# EAGLE design A4a ESP32 WiFi BLE (EAGLE 9.6.2)
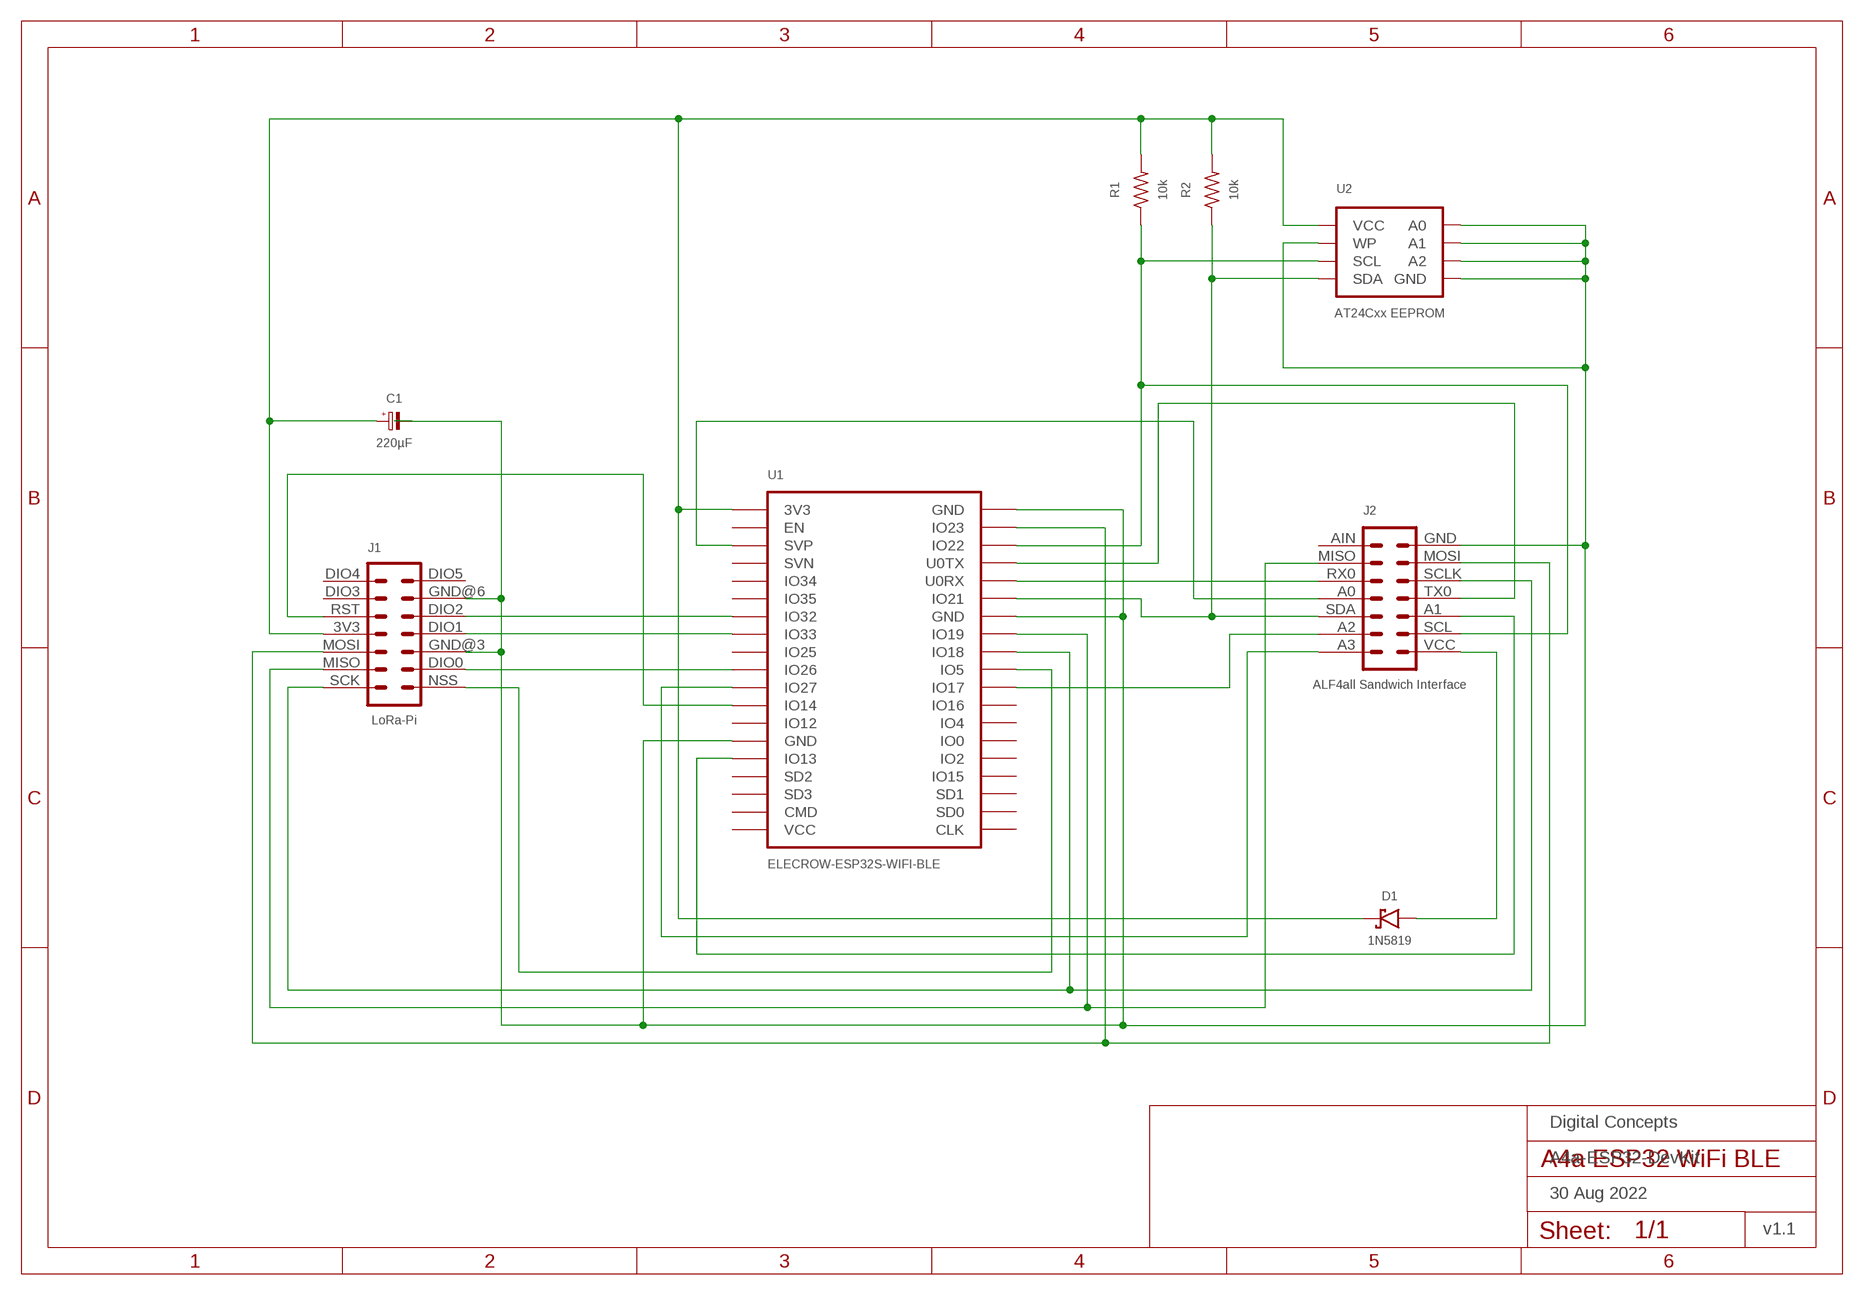
[diagram p0: schematic, sheet 1]
FRAME1 (A4L-LOC): DATE: 30 Aug 2022; OWNER: Digital Concepts; TITLE: A4a-ESP32-DevKit; VERSION: v1.1

## Parts
C1  220µF  CAPACITOR-3528-TANTALUM  [C3528-21]
D1  1N5819  DIODE-SCHOTTKY-1N5819  [SOD-123]
J1  LoRa-Pi  RFM95W-PI-HEADER  [RFM95W-PI]
J2  ALF4all Sandwich Interface  HEADER-2X7-ALF4ALL-PROCESSOR-B  [CONN_2X7-ALF4ALL-PROCESSOR-B]
R1  10k  RESISTORR0805  [R0805]
R2  10k  RESISTORR0805  [R0805]
U1  ELECROW-ESP32S-WIFI-BLE  [ELECROW-ESP32S-WIFI-BLE]
U2  AT24Cxx EEPROM  AT24CXX-EEPROM  [SOP-8]

## Nets
GND: C1.2(-) J1.GND@3 J1.GND@6 J2.GND U1.GND@13(GND) U1.GND@19(GND) U1.GND@33(GND) U2.P$1(A0) U2.P$2(A1) U2.P$3(A2) U2.P$4(GND) U2.P$7(WP)
N$2: J2.A3 U1.IO27
N$3: J2.A1 U1.IO13
N$4: J1.RST U1.IO14
N$5: D1.A J2.VCC
N$6: J1.SCK J2.SCLK U1.IO18
N$7: J2.RX0 U1.U0RX
N$9: J1.DIO0 U1.IO26
N$10: J2.SDA R2.1 U1.IO21 U2.P$5(SDA)
N$11: J2.SCL R1.1 U1.IO22 U2.P$6(SCL)
N$12: J1.MISO J2.MISO U1.IO19
N$13: J1.MOSI J2.MOSI U1.IO23
N$14: J2.TX0 U1.U0TX
N$15: J1.NSS U1.IO5
N$17: J2.A2 U1.IO17
N$21: J1.DIO1 U1.IO33
N$22: J1.DIO2 U1.IO32
N$23: J2.A0 U1.SVP
VCC: C1.1(+) D1.C J1.3V3 R1.2 R2.2 U1.3V3 U2.P$8(VCC)
Unconnected: J1.DIO3 J1.DIO4 J1.DIO5 J2.AIN U1.CLK U1.CMD U1.EN U1.IO0 U1.IO2 U1.IO4 U1.IO12 U1.IO15 U1.IO16 U1.IO25 U1.IO34 U1.IO35 U1.SD0 U1.SD1 U1.SD2 U1.SD3 U1.SVN U1.VCC

## Library data of the parts
C1 = digitalconcepts:CAPACITOR-3528-TANTALUM: Capacitor Tantalum 3528 (KEMET B)
D1 = digitalconcepts:DIODE-SCHOTTKY-1N5819: 1N5819 Schottky Diode SOD-123
J1 = digitalconcepts:RFM95W-PI-HEADER: RFM95W LoRa Wireless Transceiver Raspberry Pi Daughter Board
J2 = digitalconcepts:HEADER-2X7-ALF4ALL-PROCESSOR-B: ALF4all 'Sandwich' Processor (Bottom) 2x7 Pin Header Header soldered to underside of PCB
R1 R2 = digitalconcepts:RESISTOR: Resistor; SPICEPREFIX: R
U1 = digitalconcepts:ELECROW-ESP32S-WIFI-BLE: Elecrow ESP32S WiFi/BLE DevKit
U2 = digitalconcepts:AT24CXX-EEPROM: AT24Cxx EEPROM SOP-8

## Board
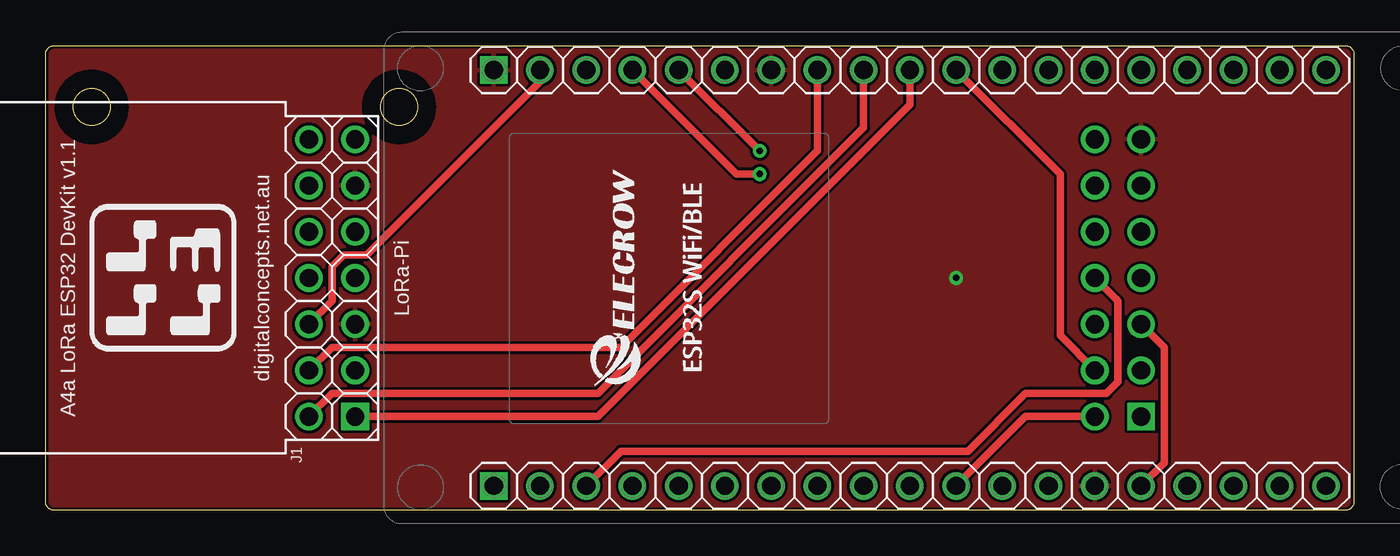
[diagram p1: board, top side]
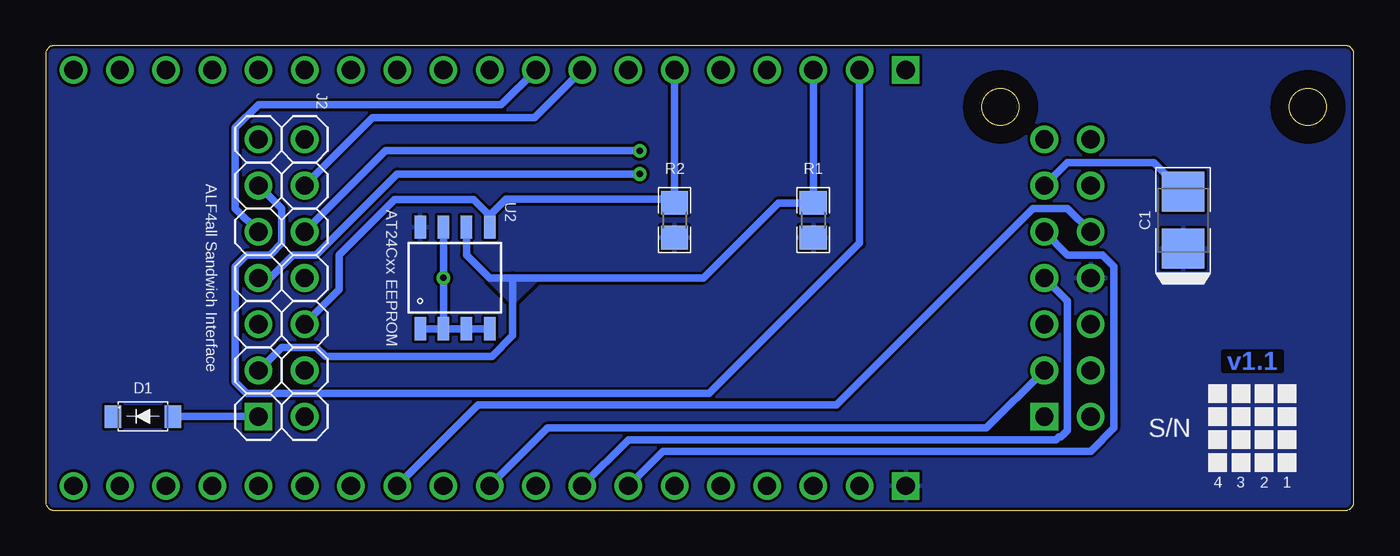
[diagram p2: board, bottom side, seen from below]

Size 71.89 x 25.56 mm. Coordinates in mm from the lower left corner, seen from the top.
Outline: 71.43,25.56 71.46,25.56 71.5,25.55 71.53,25.54 71.56,25.53 71.59,25.52 71.62,25.51 71.65,25.49 71.67,25.48 71.7,25.46 71.72,25.44 71.74,25.41 71.77,25.39 71.79,25.37 71.8,25.34 71.82,25.31 71.84,25.28 71.86,25.22 71.87,25.19 71.88,25.16 71.89,25.13 71.89,25.1 71.89,0.47 71.89,0.43 71.88,0.4 71.87,0.37 71.86,0.33 71.84,0.28 71.82,0.25 71.8,0.22 71.79,0.19 71.77,0.17 71.74,0.15 71.72,0.12 71.7,0.1 71.67,0.09 71.65,0.07 71.62,0.05 71.59,0.04 71.56,0.03 71.53,0.02 71.5,0.01 71.46,0 71.43,0 0.46,0 0.42,0 0.39,0.01 0.36,0.02 0.33,0.03 0.27,0.05 0.24,0.07 0.22,0.09 0.19,0.1 0.17,0.12 0.14,0.15 0.12,0.17 0.1,0.19 0.08,0.22 0.07,0.25 0.05,0.28 0.04,0.31 0.03,0.33 0.02,0.37 0.01,0.4 0,0.43 0,0.47 0,25.1 0,25.13 0.01,25.16 0.02,25.19 0.03,25.22 0.04,25.25 0.05,25.28 0.07,25.31 0.08,25.34 0.1,25.37 0.12,25.39 0.17,25.44 0.19,25.46 0.22,25.48 0.24,25.49 0.27,25.51 0.33,25.53 0.36,25.54 0.39,25.55 0.42,25.56 0.46,25.56 71.43,25.56
Outline: circle at 19.42,22.18 radius 1.02
Outline: circle at 2.53,22.18 radius 1.02
Copper layers (1*16): Top 0.035mm / dielectric 1.5mm / Bottom 0.035mm
Design rules "default *": minimum track width 6mil, minimum drill 0.35mm, track to track 6mil, track to pad 6mil, pad to pad 6mil, via to via 6mil, smd to smd 6mil, copper to edge 6mil, drill to drill 6mil, minimum pad ring 10mil, minimum via ring 8mil, stop-mask expansion 4mil, vias tented up to drill 0mil, thermal gap 6mil

### Footprints (pad centres in the part's own frame; a part is rotated, then mirrored left to right if it is on the bottom)
C3528-21 = smd 2.21 x 2.35: 1 -1.565,0; 2 1.565,0
SOD-123 = smd 0.91 x 1.22: A -1.65,0; C 1.65,0
RFM95W-PI = drill 1 pad 1.524: 3V3 7.62,2.54; DIO0 2.54,0; DIO1 7.62,0; DIO2 10.16,0; DIO3 12.7,2.54; DIO4 15.24,2.54; DIO5 15.24,0; GND@3 5.08,0; GND@6 12.7,0; MISO 2.54,2.54; MOSI 5.08,2.54; RST 10.16,2.54; SCK 0,2.54 | drill 1 pad 1.524 square: NSS 0,0
CONN_2X7-ALF4ALL-PROCESSOR-B = drill 1 pad 1.524: A0 7.62,2.54; A1 5.08,0; A2 2.54,2.54; A3 0,2.54; AIN 15.24,2.54; GND 15.24,0; MISO 12.7,2.54; MOSI 12.7,0; RX0 10.16,2.54; SCL 2.54,0; SCLK 10.16,0; SDA 5.08,2.54; TX0 7.62,0 | drill 1 pad 1.524 square: VCC 0,0
R0805 = smd 1.3 x 1.5: 1 -0.95,0; 2 0.95,0
ELECROW-ESP32S-WIFI-BLE = drill 1 square: 3V3 -22.86,45.72; GND@19 0,45.72 | drill 1: CLK 0,0; CMD -22.86,2.54; EN -22.86,43.18; GND@13 0,30.48; GND@33 -22.86,12.7; IO0 0,12.7; IO2 0,10.16; IO4 0,15.24; IO5 0,22.86; IO12 -22.86,15.24; IO13 -22.86,10.16; IO14 -22.86,17.78; IO15 0,7.62; IO16 0,17.78; IO17 0,20.32; IO18 0,25.4; IO19 0,27.94; IO21 0,33.02; IO22 0,40.64; IO23 0,43.18; IO25 -22.86,25.4; IO26 -22.86,22.86; IO27 -22.86,20.32; IO32 -22.86,30.48; IO33 -22.86,27.94; IO34 -22.86,35.56; IO35 -22.86,33.02; SD0 0,2.54; SD1 0,5.08; SD2 -22.86,7.62; SD3 -22.86,5.08; SVN -22.86,38.1; SVP -22.86,40.64; U0RX 0,35.56; U0TX 0,38.1; VCC -22.86,0
SOP-8 = smd 0.635 x 1.27: P$1 -1.905,-2.794; P$2 -0.635,-2.794; P$3 0.635,-2.794; P$4 1.905,-2.794; P$5 1.905,2.794; P$6 0.635,2.794; P$7 -0.635,2.794; P$8 -1.905,2.794

### Placement (x,y rotation side)
C1  9.39,15.96 90 bottom
D1  66.54,5.16 180 bottom
J1  17.01,5.16 90 top
J2  60.19,5.16 90 top
R1  29.71,15.96 270 bottom
R2  37.33,15.96 270 bottom
U1  70.35,24.21 90 top
U2  49.39,12.78 0 bottom

### Tracks (layer width: path | path; a pad name or v marks a point on that pad's centre or on a via)
$X1
  cutout Top: 2.53,24.21 arc180 2.53,20.15 arc180
$X2
  cutout Bottom: 2.53,24.21 arc180 2.53,20.15 arc180
$X3
  cutout Top: 19.42,24.21 arc180 19.42,20.15 arc180
$X4
  cutout Bottom: 19.42,24.21 arc180 19.42,20.15 arc180
GND  (via drill 0.35)
  Bottom 0.406: U2.P$1 U2.P$2 | U2.P$7 v50.03,12.78 U2.P$2 | U2.P$2 U2.P$3 U2.P$4 | J1.GND@6 15.74,19.13 11,19.13 C1.2
  pour Top (rank 5): -1.41,26.75 72.89,26.75 72.89,-1.19 -1.41,-1.19
N$2
  Top 0.406: U1.IO27 53.84,5.16 J2.A3
N$3
  Top 0.406: U1.IO13 61.46,2.62 61.46,8.97 J2.A1
N$4
  Bottom 0.406: J1.RST 15.74,16.59 17.64,16.59 28.44,5.8 48.12,5.8 U1.IO14
N$5
  Bottom 0.406: J2.VCC D1.A
N$6
  Top 0.406: J1.SCK 15.74,6.43 30.34,6.43 44.95,21.04 U1.IO18
  Bottom 0.406: J2.SCLK 61.46,16.59 61.46,21.04 60.19,22.31 46.85,22.31 U1.IO18
N$7  (via drill 0.35)
  Top 0.406: U1.U0RX v39.23,19.77
  Bottom 0.406: J2.RX0 53.2,19.77 v39.23,19.77
N$9
  Bottom 0.406: J1.DIO0 20.18,4.53 44.31,4.53 U1.IO26
N$10
  Bottom 0.406: U2.P$5 47.49,16.21 | 47.49,16.21 48.38,17.1 52.7,17.1 55.74,14.05 55.74,12.15 J2.SDA | 47.49,16.21 46.57,17.13 37.55,17.13 R2.1 U1.IO21
N$11
  Bottom 0.406: J2.SCL 58.92,8.97 57.01,8.97 56.51,8.46 47.36,8.46 46.22,9.61 46.22,12.78 | U2.P$6 48.76,14.05 47.49,12.78 46.22,12.78 | 46.22,12.78 35.74,12.78 31.62,16.91 R1.1 U1.IO22
  pour Bottom: 47.49,12.78 44.95,12.78 46.22,11.51
N$12
  Top 0.406: J1.MISO 15.74,8.97 31.61,8.97 42.41,19.77 U1.IO19
  Bottom 0.406: J2.MISO 53.91,21.6 45.02,21.6 U1.IO19
N$13
  Top 0.406: J1.MOSI 15.74,11.51 15.74,13.42 16.37,14.05 17.64,14.05 27.17,23.58 U1.IO23
  Bottom 0.406: J2.MOSI 58.92,16.59 58.92,14.69 59.55,14.05 60.82,14.05 61.46,13.42 61.46,7.07 60.82,6.43 35.42,6.43 27.17,14.69 U1.IO23
N$14  (via drill 0.35)
  Top 0.406: v39.23,18.5 37.96,18.5 U1.U0TX
  Bottom 0.406: J2.TX0 59.55,12.78 58.28,14.05 57.01,14.05 52.57,18.5 v39.23,18.5
N$15
  Top 0.406: U1.IO5 47.49,22.31 30.34,5.16 J1.NSS
N$17
  Top 0.406: J2.A2 55.74,9.61 55.74,18.5 U1.IO17
N$21
  Bottom 0.406: J1.DIO1 15.74,11.51 15.74,4.41 16.1,4.04 16.22,4.04 16.37,3.89 39.87,3.89 U1.IO33
N$22
  Bottom 0.406: J1.DIO2 15.74,14.05 13.83,14.05 13.2,13.42 13.2,4.53 14.47,3.26 37.96,3.26 U1.IO32
N$23
  Top 0.406: J2.A0 58.92,11.51 58.92,7.07 58.28,6.43 53.84,6.43 50.66,3.26 31.61,3.26 U1.SVP
VCC
  pour Bottom (rank 5): -0.77,26.12 72.25,26.12 72.25,-0.55 -0.77,-0.55

### Text on the board
Bottom: v1.1
tPlace: A4a LoRa ESP32 DevKit v1.1 | digitalconcepts.net.au
bPlace: S/N | 1 | 2 | 3 | 4